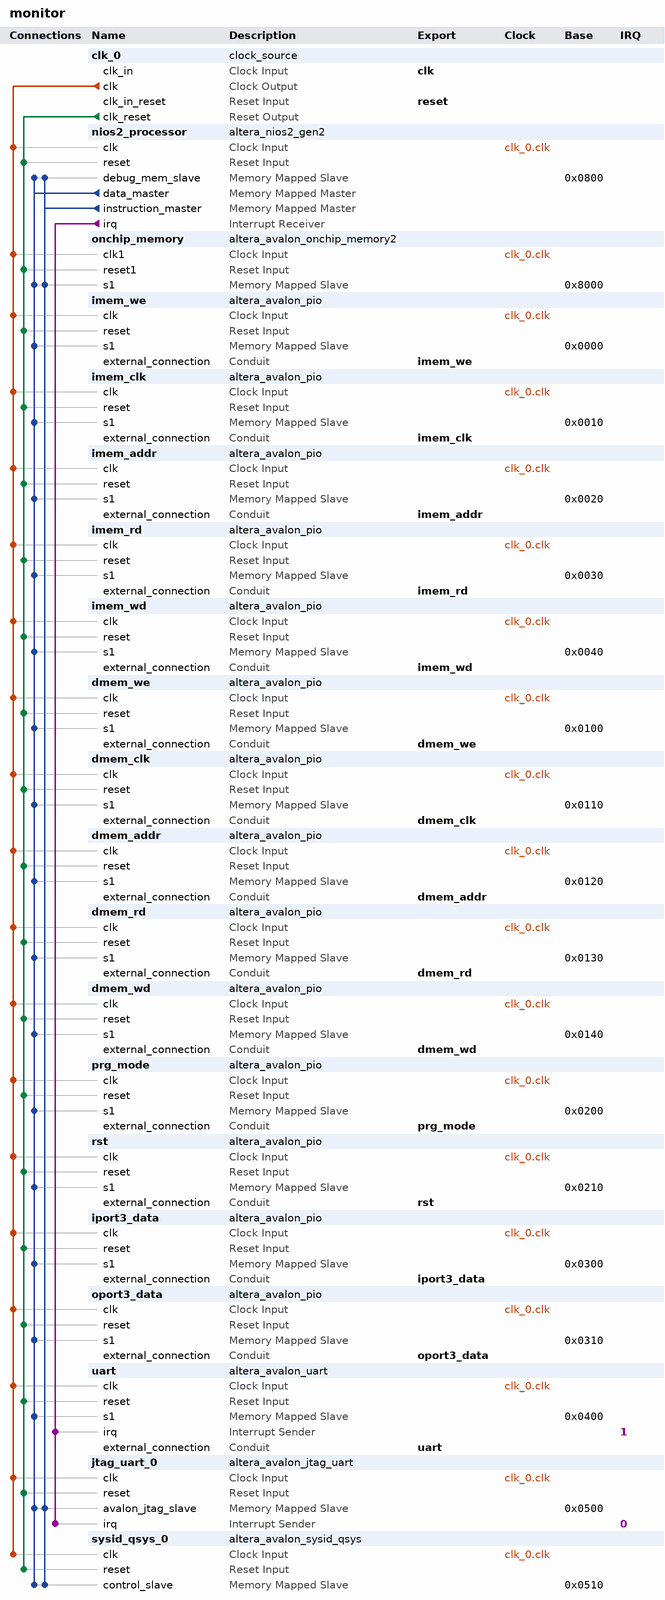
[diagram p0: system contents]
# Platform Designer (Qsys) system monitor, Cyclone V 5CEBA4F23C7
# Parameters at their usual value, and those the tool derives, are not listed.
package require -exact qsys 15.1
create_system monitor
set_project_property DEVICE_FAMILY {Cyclone V}
set_project_property DEVICE 5CEBA4F23C7

add_instance clk_0 clock_source 15.1
set_instance_parameter_value clk_0 clockFrequency 50000000

add_instance nios2_processor altera_nios2_gen2 15.1
set_instance_parameter_value nios2_processor dcache_size 2048
set_instance_parameter_value nios2_processor exceptionSlave onchip_memory.s1
set_instance_parameter_value nios2_processor icache_size 4096
set_instance_parameter_value nios2_processor impl Tiny
set_instance_parameter_value nios2_processor resetSlave onchip_memory.s1

add_instance onchip_memory altera_avalon_onchip_memory2 15.1
set_instance_parameter_value onchip_memory dataWidth 32
set_instance_parameter_value onchip_memory dualPort false
set_instance_parameter_value onchip_memory initMemContent true
set_instance_parameter_value onchip_memory initializationFileName onchip_mem.hex
set_instance_parameter_value onchip_memory memorySize 8192

add_instance imem_we altera_avalon_pio 15.1
set_instance_parameter_value imem_we direction Output
set_instance_parameter_value imem_we width 1

add_instance imem_clk altera_avalon_pio 15.1
set_instance_parameter_value imem_clk direction Output
set_instance_parameter_value imem_clk width 1

add_instance imem_addr altera_avalon_pio 15.1
set_instance_parameter_value imem_addr direction Output
set_instance_parameter_value imem_addr width 32

add_instance imem_rd altera_avalon_pio 15.1
set_instance_parameter_value imem_rd direction Input
set_instance_parameter_value imem_rd width 32

add_instance imem_wd altera_avalon_pio 15.1
set_instance_parameter_value imem_wd direction Output
set_instance_parameter_value imem_wd width 32

add_instance dmem_we altera_avalon_pio 15.1
set_instance_parameter_value dmem_we direction Output
set_instance_parameter_value dmem_we width 1

add_instance dmem_clk altera_avalon_pio 15.1
set_instance_parameter_value dmem_clk direction Output
set_instance_parameter_value dmem_clk width 1

add_instance dmem_addr altera_avalon_pio 15.1
set_instance_parameter_value dmem_addr direction Output
set_instance_parameter_value dmem_addr width 32

add_instance dmem_rd altera_avalon_pio 15.1
set_instance_parameter_value dmem_rd direction Input
set_instance_parameter_value dmem_rd width 32

add_instance dmem_wd altera_avalon_pio 15.1
set_instance_parameter_value dmem_wd direction Output
set_instance_parameter_value dmem_wd width 32

add_instance prg_mode altera_avalon_pio 15.1
set_instance_parameter_value prg_mode direction Output
set_instance_parameter_value prg_mode width 1

add_instance rst altera_avalon_pio 15.1
set_instance_parameter_value rst direction Output
set_instance_parameter_value rst width 1

add_instance iport3_data altera_avalon_pio 15.1
set_instance_parameter_value iport3_data direction Output
set_instance_parameter_value iport3_data width 32

add_instance oport3_data altera_avalon_pio 15.1
set_instance_parameter_value oport3_data direction Input
set_instance_parameter_value oport3_data width 32

add_instance uart altera_avalon_uart 15.1
set_instance_parameter_value uart baud 9600
set_instance_parameter_value uart dataBits 8
set_instance_parameter_value uart fixedBaud true
set_instance_parameter_value uart parity NONE
set_instance_parameter_value uart stopBits 1

add_instance jtag_uart_0 altera_avalon_jtag_uart 15.1
set_instance_parameter_value jtag_uart_0 simInteractiveOptions NO_INTERACTIVE_WINDOWS

add_instance sysid_qsys_0 altera_avalon_sysid_qsys 15.1
set_instance_parameter_value sysid_qsys_0 id 4660

# connections
add_connection clk_0.clk dmem_addr.clk clock
add_connection clk_0.clk dmem_clk.clk clock
add_connection clk_0.clk dmem_rd.clk clock
add_connection clk_0.clk dmem_wd.clk clock
add_connection clk_0.clk dmem_we.clk clock
add_connection clk_0.clk imem_addr.clk clock
add_connection clk_0.clk imem_clk.clk clock
add_connection clk_0.clk imem_rd.clk clock
add_connection clk_0.clk imem_wd.clk clock
add_connection clk_0.clk imem_we.clk clock
add_connection clk_0.clk iport3_data.clk clock
add_connection clk_0.clk jtag_uart_0.clk clock
add_connection clk_0.clk nios2_processor.clk clock
add_connection clk_0.clk onchip_memory.clk1 clock
add_connection clk_0.clk oport3_data.clk clock
add_connection clk_0.clk prg_mode.clk clock
add_connection clk_0.clk rst.clk clock
add_connection clk_0.clk sysid_qsys_0.clk clock
add_connection clk_0.clk uart.clk clock
add_connection clk_0.clk_reset dmem_addr.reset reset
add_connection clk_0.clk_reset dmem_clk.reset reset
add_connection clk_0.clk_reset dmem_rd.reset reset
add_connection clk_0.clk_reset dmem_wd.reset reset
add_connection clk_0.clk_reset dmem_we.reset reset
add_connection clk_0.clk_reset imem_addr.reset reset
add_connection clk_0.clk_reset imem_clk.reset reset
add_connection clk_0.clk_reset imem_rd.reset reset
add_connection clk_0.clk_reset imem_wd.reset reset
add_connection clk_0.clk_reset imem_we.reset reset
add_connection clk_0.clk_reset iport3_data.reset reset
add_connection clk_0.clk_reset jtag_uart_0.reset reset
add_connection clk_0.clk_reset nios2_processor.reset reset
add_connection clk_0.clk_reset onchip_memory.reset1 reset
add_connection clk_0.clk_reset oport3_data.reset reset
add_connection clk_0.clk_reset prg_mode.reset reset
add_connection clk_0.clk_reset rst.reset reset
add_connection clk_0.clk_reset sysid_qsys_0.reset reset
add_connection clk_0.clk_reset uart.reset reset
add_connection nios2_processor.data_master dmem_addr.s1 avalon
set_connection_parameter_value nios2_processor.data_master/dmem_addr.s1 baseAddress 0x0120
add_connection nios2_processor.data_master dmem_clk.s1 avalon
set_connection_parameter_value nios2_processor.data_master/dmem_clk.s1 baseAddress 0x0110
add_connection nios2_processor.data_master dmem_rd.s1 avalon
set_connection_parameter_value nios2_processor.data_master/dmem_rd.s1 baseAddress 0x0130
add_connection nios2_processor.data_master dmem_wd.s1 avalon
set_connection_parameter_value nios2_processor.data_master/dmem_wd.s1 baseAddress 0x0140
add_connection nios2_processor.data_master dmem_we.s1 avalon
set_connection_parameter_value nios2_processor.data_master/dmem_we.s1 baseAddress 0x0100
add_connection nios2_processor.data_master imem_addr.s1 avalon
set_connection_parameter_value nios2_processor.data_master/imem_addr.s1 baseAddress 0x0020
add_connection nios2_processor.data_master imem_clk.s1 avalon
set_connection_parameter_value nios2_processor.data_master/imem_clk.s1 baseAddress 0x0010
add_connection nios2_processor.data_master imem_rd.s1 avalon
set_connection_parameter_value nios2_processor.data_master/imem_rd.s1 baseAddress 0x0030
add_connection nios2_processor.data_master imem_wd.s1 avalon
set_connection_parameter_value nios2_processor.data_master/imem_wd.s1 baseAddress 0x0040
add_connection nios2_processor.data_master imem_we.s1 avalon
set_connection_parameter_value nios2_processor.data_master/imem_we.s1 baseAddress 0x0000
add_connection nios2_processor.data_master iport3_data.s1 avalon
set_connection_parameter_value nios2_processor.data_master/iport3_data.s1 baseAddress 0x0300
add_connection nios2_processor.data_master jtag_uart_0.avalon_jtag_slave avalon
set_connection_parameter_value nios2_processor.data_master/jtag_uart_0.avalon_jtag_slave baseAddress 0x0500
add_connection nios2_processor.data_master nios2_processor.debug_mem_slave avalon
set_connection_parameter_value nios2_processor.data_master/nios2_processor.debug_mem_slave baseAddress 0x0800
add_connection nios2_processor.data_master onchip_memory.s1 avalon
set_connection_parameter_value nios2_processor.data_master/onchip_memory.s1 baseAddress 0x8000
add_connection nios2_processor.data_master oport3_data.s1 avalon
set_connection_parameter_value nios2_processor.data_master/oport3_data.s1 baseAddress 0x0310
add_connection nios2_processor.data_master prg_mode.s1 avalon
set_connection_parameter_value nios2_processor.data_master/prg_mode.s1 baseAddress 0x0200
add_connection nios2_processor.data_master rst.s1 avalon
set_connection_parameter_value nios2_processor.data_master/rst.s1 baseAddress 0x0210
add_connection nios2_processor.data_master sysid_qsys_0.control_slave avalon
set_connection_parameter_value nios2_processor.data_master/sysid_qsys_0.control_slave baseAddress 0x0510
add_connection nios2_processor.data_master uart.s1 avalon
set_connection_parameter_value nios2_processor.data_master/uart.s1 baseAddress 0x0400
add_connection nios2_processor.instruction_master jtag_uart_0.avalon_jtag_slave avalon
set_connection_parameter_value nios2_processor.instruction_master/jtag_uart_0.avalon_jtag_slave baseAddress 0x0500
add_connection nios2_processor.instruction_master nios2_processor.debug_mem_slave avalon
set_connection_parameter_value nios2_processor.instruction_master/nios2_processor.debug_mem_slave baseAddress 0x0800
add_connection nios2_processor.instruction_master onchip_memory.s1 avalon
set_connection_parameter_value nios2_processor.instruction_master/onchip_memory.s1 baseAddress 0x8000
add_connection nios2_processor.instruction_master sysid_qsys_0.control_slave avalon
set_connection_parameter_value nios2_processor.instruction_master/sysid_qsys_0.control_slave baseAddress 0x0510
add_connection nios2_processor.irq jtag_uart_0.irq interrupt
set_connection_parameter_value nios2_processor.irq/jtag_uart_0.irq irqNumber 0
add_connection nios2_processor.irq uart.irq interrupt
set_connection_parameter_value nios2_processor.irq/uart.irq irqNumber 1

# exported interfaces
add_interface clk clock sink
set_interface_property clk EXPORT_OF clk_0.clk_in
add_interface dmem_addr conduit end
set_interface_property dmem_addr EXPORT_OF dmem_addr.external_connection
add_interface dmem_clk conduit end
set_interface_property dmem_clk EXPORT_OF dmem_clk.external_connection
add_interface dmem_rd conduit end
set_interface_property dmem_rd EXPORT_OF dmem_rd.external_connection
add_interface dmem_wd conduit end
set_interface_property dmem_wd EXPORT_OF dmem_wd.external_connection
add_interface dmem_we conduit end
set_interface_property dmem_we EXPORT_OF dmem_we.external_connection
add_interface imem_addr conduit end
set_interface_property imem_addr EXPORT_OF imem_addr.external_connection
add_interface imem_clk conduit end
set_interface_property imem_clk EXPORT_OF imem_clk.external_connection
add_interface imem_rd conduit end
set_interface_property imem_rd EXPORT_OF imem_rd.external_connection
add_interface imem_wd conduit end
set_interface_property imem_wd EXPORT_OF imem_wd.external_connection
add_interface imem_we conduit end
set_interface_property imem_we EXPORT_OF imem_we.external_connection
add_interface iport3_data conduit end
set_interface_property iport3_data EXPORT_OF iport3_data.external_connection
add_interface oport3_data conduit end
set_interface_property oport3_data EXPORT_OF oport3_data.external_connection
add_interface prg_mode conduit end
set_interface_property prg_mode EXPORT_OF prg_mode.external_connection
add_interface reset reset sink
set_interface_property reset EXPORT_OF clk_0.clk_in_reset
add_interface rst conduit end
set_interface_property rst EXPORT_OF rst.external_connection
add_interface uart conduit end
set_interface_property uart EXPORT_OF uart.external_connection

set_interconnect_requirement {$system} qsys_mm.clockCrossingAdapter HANDSHAKE
set_interconnect_requirement {$system} qsys_mm.enableEccProtection FALSE
set_interconnect_requirement {$system} qsys_mm.insertDefaultSlave FALSE
set_interconnect_requirement {$system} qsys_mm.maxAdditionalLatency 1

save_system monitor.qsys
